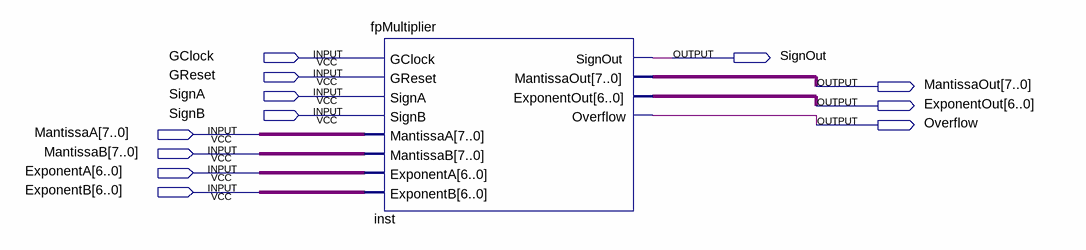
[diagram p0: schematic sheet]
// Quartus schematic FPM.bdf as structural Verilog: 1 symbols, 12 pins
module FPM (
  input  GClock,
  input  GReset,
  input  SignA,
  input  SignB,
  input  [7:0] MantissaA,
  input  [7:0] MantissaB,
  input  [6:0] ExponentA,
  input  [6:0] ExponentB,
  output SignOut,
  output [7:0] MantissaOut,
  output [6:0] ExponentOut,
  output Overflow
);

  fpMultiplier inst (
    .GClock(GClock), .GReset(GReset), .SignA(SignA), .SignB(SignB), .MantissaA(MantissaA),
    .MantissaB(MantissaB), .ExponentA(ExponentA), .ExponentB(ExponentB), .SignOut(SignOut),
    .MantissaOut(MantissaOut), .ExponentOut(ExponentOut), .Overflow(Overflow));
endmodule
